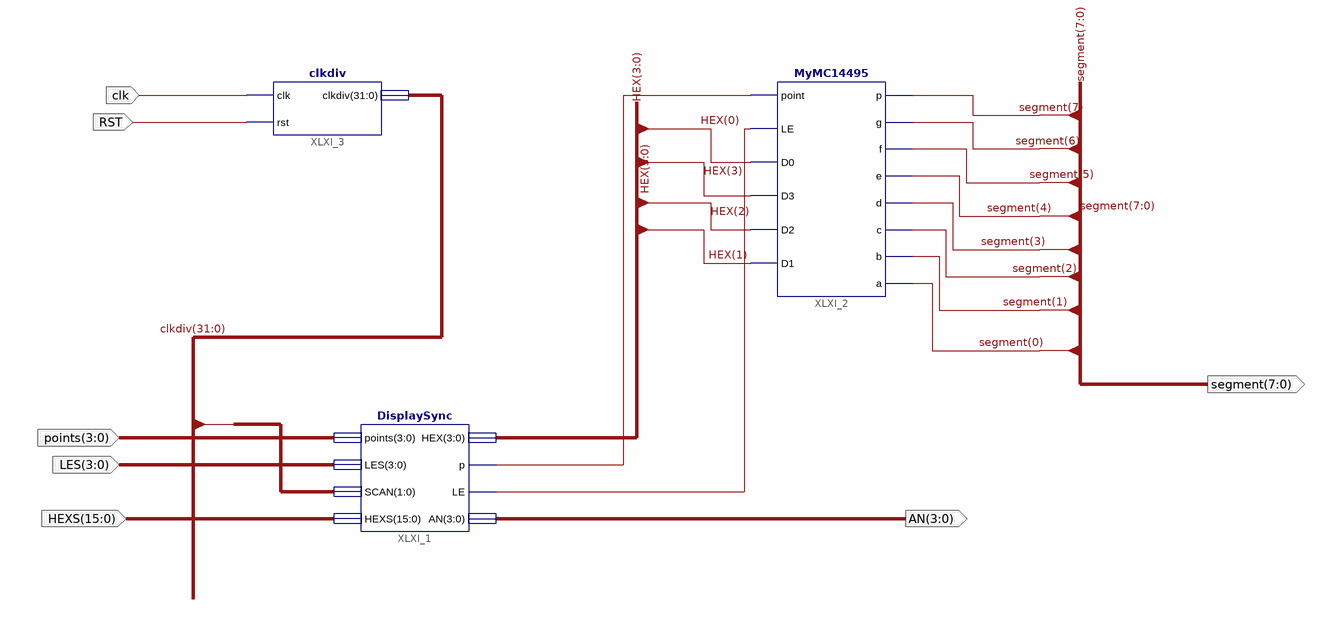
[diagram p0: schematic sheet 1]
// Xilinx ISE schematic disp_num.sch (kintex7) as structural Verilog: 3 symbols, 7 ports
module disp_num (
  input  clk,
  input  RST,
  input  [3:0] LES,
  input  [15:0] HEXS,
  input  [3:0] points,
  output [3:0] AN,
  output [7:0] segment
);

  wire XLXN_18, XLXN_19;
  wire [3:0] HEX;
  wire [31:0] clkdiv;

  DisplaySync XLXI_1 (
    .points(points), .LES(LES), .SCAN(clkdiv[18:17]), .HEXS(HEXS), .HEX(HEX), .p(XLXN_19), .LE(XLXN_18),
    .AN(AN));
  MyMC14495 XLXI_2 (
    .point(XLXN_19), .LE(XLXN_18), .D0(HEX[0]), .D3(HEX[3]), .D2(HEX[2]), .D1(HEX[1]), .p(segment[7]),
    .g(segment[6]), .f(segment[5]), .e(segment[4]), .d(segment[3]), .c(segment[2]), .b(segment[1]),
    .a(segment[0]));
  clkdiv XLXI_3 (.clk(clk), .rst(RST), .clkdiv(clkdiv));
endmodule
